# Altium schematic sheet TEMPLATE_Title.SchDoc
size Tabloid; Date: Date; Author: Author 1; Revision: 1; SheetNumber: 1; SheetTotal: 5; Size: 11x17; Sheet_Name: Sheet Description
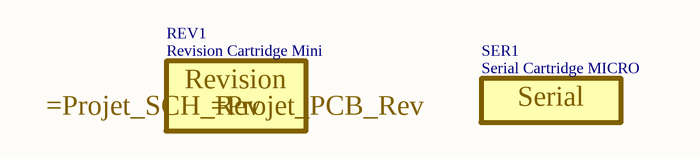
[diagram p0: TEMPLATE_Title.SchDoc]

## Parts
REV1  Revision Cartridge Mini  [REV_REVISION_CARTRIDGE_MINI]  (no BOM)
SER1  Serial Cartridge MICRO  [SER_SERIAL_CARTRIDGE_MICRO]  (no BOM)

## Notes on the sheet
- Projet initial
- Historique de révision
- 1.0
- Légende
- Conversion des boitiers
- Notes Générales
- Métrique
- 1005
- 1608
- Impérial
- 0402
- 0603
- Revision
- .
- Notes PCB
- 2012
- 3216
- 0805
- 1206
- Notes Programmation
- 3225
- 6432
- 1210
- 2512
- Date :
- Variants
- RÉVISION & NUMÉRO DE SÉRIE
- Titre du projet
- Cours associé au projet
- Taille
- Département
- Technologies du
- Révision
- PCB
- SCH
- Date
- génie électrique
- Feuille
- Variant
- de
- Concepteurs
- (in symbol REV_REVISION_CARTRIDGE_MINI) Revision; .
- (in symbol SER_SERIAL_CARTRIDGE_MICRO) Serial

## Library data of the parts
REV1 = REV_REVISION_CARTRIDGE_MINI: REV - REVISION CARTRIDGE MINI; Rule: UNIONINDEX=0|RULEKIND=ComponentClearance|NETSCOPE=AnyNet|LAYERKIND=SameLayer|NAME=Schematic Component Clearance Constraint|GAP=0mil|COLLISIONCHECKMODE=3|VERTICALGAP=0mil|SHOWDISTANCES=FALSE|UNIT=Imperial; Value: *; Power Max: *; HelpURL: *; Package: *; Manufacturer #1: *; Note: *; Assembly Type: NONE; Part Number #1: *; Polarized: *; Supplier 1: *; Supplier Part Number 1: *
SER1 = SER_SERIAL_CARTRIDGE_MICRO: SER - SERIAL CARTRIDGE MICRO; Rule: UNIONINDEX=0|RULEKIND=ComponentClearance|NETSCOPE=AnyNet|LAYERKIND=SameLayer|NAME=Schematic Component Clearance Constraint|GAP=0mil|COLLISIONCHECKMODE=3|VERTICALGAP=0mil|SHOWDISTANCES=FALSE|UNIT=Imperial; Value: *; Power Max: *; HelpURL: *; Package: *; Manufacturer #1: *; Note: *; Assembly Type: NONE; Part Number #1: *; Polarized: *; Supplier 1: *; Supplier Part Number 1: *